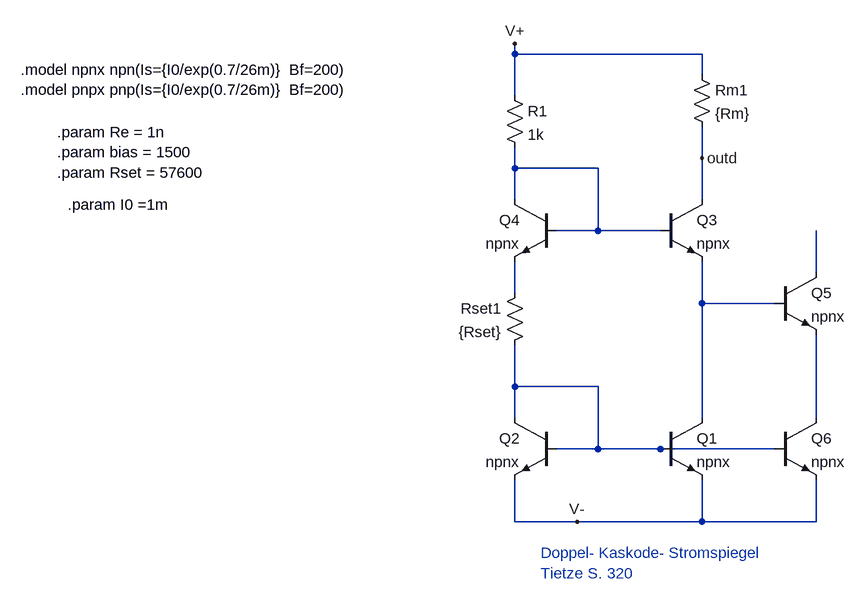
[diagram p0: schematic kaskode_zur_pegelanpassung_ohne_hv_OpAmp.asc]
kaskode_zur_pegelanpassung_ohne_hv_OpAmp.asc, the LTspice schematic file:
Version 4
SHEET 1 880 680
WIRE -624 -656 -624 -672
WIRE -336 -656 -624 -656
WIRE -336 -624 -336 -656
WIRE -624 -592 -624 -656
WIRE -336 -496 -336 -544
WIRE -624 -480 -624 -512
WIRE -496 -480 -624 -480
WIRE -624 -432 -624 -480
WIRE -336 -432 -336 -496
WIRE -496 -384 -496 -480
WIRE -496 -384 -560 -384
WIRE -400 -384 -496 -384
WIRE -160 -320 -160 -384
WIRE -624 -288 -624 -336
WIRE -336 -272 -336 -336
WIRE -224 -272 -336 -272
WIRE -624 -144 -624 -208
WIRE -496 -144 -624 -144
WIRE -624 -96 -624 -144
WIRE -336 -96 -336 -272
WIRE -160 -96 -160 -224
WIRE -496 -48 -496 -144
WIRE -496 -48 -560 -48
WIRE -400 -48 -496 -48
WIRE -224 -48 -400 -48
WIRE -624 64 -624 0
WIRE -528 64 -624 64
WIRE -336 64 -336 0
WIRE -336 64 -528 64
WIRE -160 64 -160 0
WIRE -160 64 -336 64
FLAG -528 64 V-
FLAG -624 -672 V+
FLAG -336 -496 outd
SYMBOL npn -400 -96 R0
SYMATTR InstName Q1
SYMATTR Value npnx
SYMBOL npn -560 -96 M0
SYMATTR InstName Q2
SYMATTR Value npnx
SYMBOL npn -400 -432 R0
SYMATTR InstName Q3
SYMATTR Value npnx
SYMBOL npn -560 -432 M0
SYMATTR InstName Q4
SYMATTR Value npnx
SYMBOL res -352 -640 R0
SYMATTR InstName Rm1
SYMATTR Value {Rm}
SYMBOL res -640 -608 R0
SYMATTR InstName R1
SYMATTR Value 1k
SYMBOL res -608 -304 M0
SYMATTR InstName Rset1
SYMATTR Value {Rset}
SYMBOL npn -224 -320 R0
SYMATTR InstName Q5
SYMATTR Value npnx
SYMBOL npn -224 -96 R0
SYMATTR InstName Q6
SYMATTR Value npnx
TEXT -584 112 Left 2 ;Doppel- Kaskode- Stromspiegel\nTietze S. 320
TEXT -1384 -632 Left 2 !.model npnx npn(Is={I0/exp(0.7/26m)}  Bf=200)\n.model pnpx pnp(Is={I0/exp(0.7/26m)}  Bf=200)
TEXT -1328 -536 Left 2 !.param Re = 1n\n.param bias = 1500\n.param Rset = 57600
TEXT -1312 -424 Left 2 !.param I0 =1m

The netlist it stands for:
* kaskode_zur_pegelanpassung_ohne_hv_OpAmp.asc
Q1 N004 N005 V- 0 npnx
Q2 N005 N005 V- 0 npnx
Q3 outd N001 N004 0 npnx
Q4 N001 N001 N003 0 npnx
Rm1 V+ outd {Rm}
R1 V+ N001 1k
Rset1 N003 N005 {Rset}
Q5 N002 N004 N006 0 npnx
Q6 N006 N005 V- 0 npnx
.model NPN NPN
.model PNP PNP
.lib standard.bjt
* Doppel- Kaskode- Stromspiegel
* Tietze S. 320
.model npnx npn(Is={I0/exp(0.7/26m)}  Bf=200)
.model pnpx pnp(Is={I0/exp(0.7/26m)}  Bf=200)
.param Re = 1n
.param bias = 1500
.param Rset = 57600
.param I0 =1m
.backanno
.end